# Altium schematic sheet ADAPT.SchDoc
size 999 x 999 mm
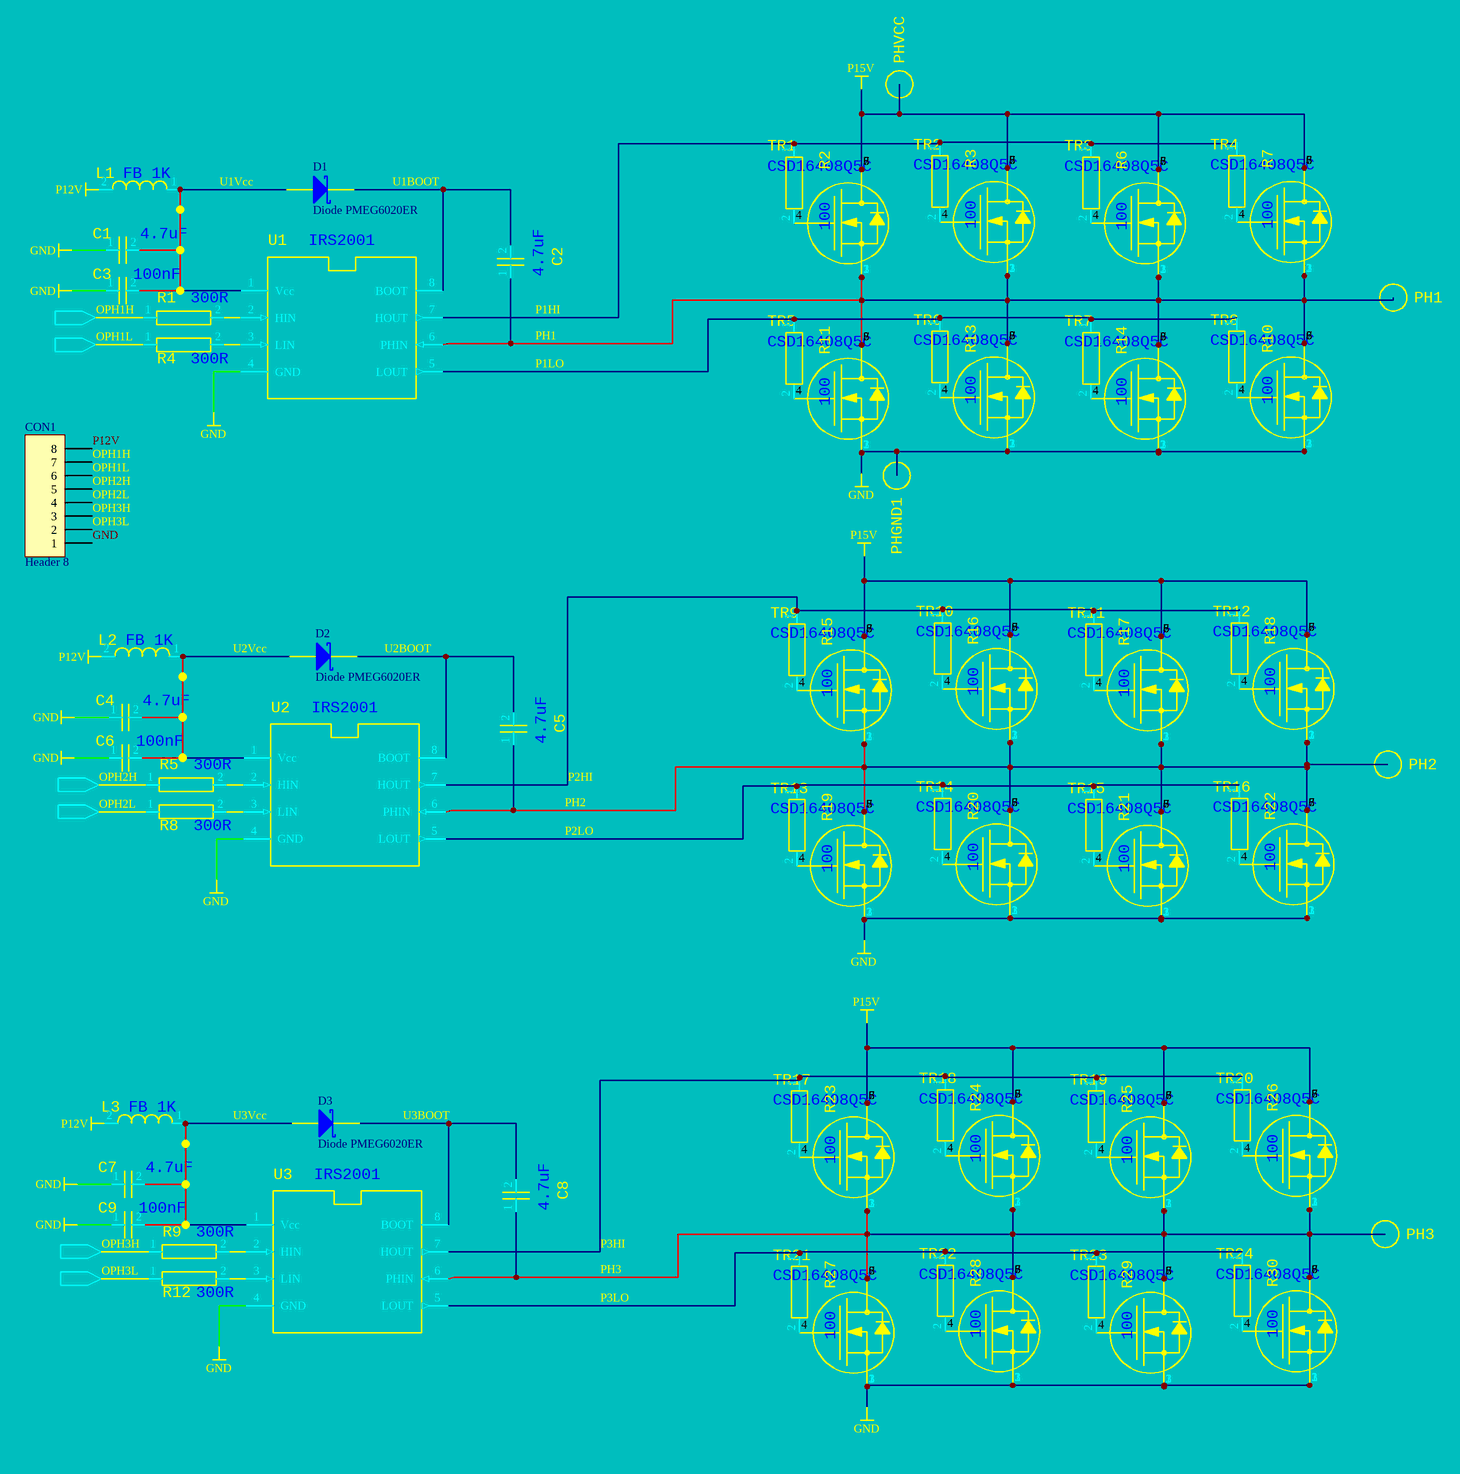
[diagram p0: ADAPT.SchDoc]

## Parts
(Parts that share a designator on the sheet are numbered #1, #2 ... from top to bottom, then left to right.)
?#1  (no value)  (graphical)
?#2  (no value)  (graphical)
?#3  (no value)  (graphical)
?#4  (no value)  (graphical)
?#5  (no value)  (graphical)
?#6  (no value)  (graphical)
C1  4.7uF  [0805_N]
C2  4.7uF  [C1206]
C3  100nF  [1608[0603]]
C4  4.7uF  [0805_N]
C5  4.7uF  [C1206]
C6  100nF  [1608[0603]]
C7  4.7uF  [0805_N]
C8  4.7uF  [C1206]
C9  100nF  [1608[0603]]
CON1  Header 8  [HDR1X8]
D1  Diode PMEG6020ER
D2  Diode PMEG6020ER
D3  Diode PMEG6020ER
L1  FB 1K  [0805_N]
L2  FB 1K  [0805_N]
L3  FB 1K  [0805_N]
PH1  PPAD  [mec-hole3.2mm /5.0 MM]  (value not drawn)
PH2  PPAD  [mec-hole3.2mm /5.0 MM]  (value not drawn)
PH3  PPAD  [mec-hole3.2mm /5.0 MM]  (value not drawn)
PHGND1  PPAD  [mec-hole3.2mm /5.0 MM]  (value not drawn)
PHVCC  PPAD  [mec-hole3.2mm /5.0 MM]  (value not drawn)
R1  300R  [1608[0603]]
R2  100  [1608[0603]]
R3  100  [1608[0603]]
R4  300R  [1608[0603]]
R5  300R  [1608[0603]]
R6  100  [1608[0603]]
R7  100  [1608[0603]]
R8  300R  [1608[0603]]
R9  300R  [1608[0603]]
R10  100  [1608[0603]]
R11  100  [1608[0603]]
R12  300R  [1608[0603]]
R13  100  [1608[0603]]
R14  100  [1608[0603]]
R15  100  [1608[0603]]
R16  100  [1608[0603]]
R17  100  [1608[0603]]
R18  100  [1608[0603]]
R19  100  [1608[0603]]
R20  100  [1608[0603]]
R21  100  [1608[0603]]
R22  100  [1608[0603]]
R23  100  [1608[0603]]
R24  100  [1608[0603]]
R25  100  [1608[0603]]
R26  100  [1608[0603]]
R27  100  [1608[0603]]
R28  100  [1608[0603]]
R29  100  [1608[0603]]
R30  100  [1608[0603]]
TR1  CSD16408Q5C  [SON5x6]
TR2  CSD16408Q5C  [SON5x6]
TR3  CSD16408Q5C  [SON5x6]
TR4  CSD16408Q5C  [SON5x6]
TR5  CSD16408Q5C  [SON5x6]
TR6  CSD16408Q5C  [SON5x6]
TR7  CSD16408Q5C  [SON5x6]
TR8  CSD16408Q5C  [SON5x6]
TR9  CSD16408Q5C  [SON5x6]
TR10  CSD16408Q5C  [SON5x6]
TR11  CSD16408Q5C  [SON5x6]
TR12  CSD16408Q5C  [SON5x6]
TR13  CSD16408Q5C  [SON5x6]
TR14  CSD16408Q5C  [SON5x6]
TR15  CSD16408Q5C  [SON5x6]
TR16  CSD16408Q5C  [SON5x6]
TR17  CSD16408Q5C  [SON5x6]
TR18  CSD16408Q5C  [SON5x6]
TR19  CSD16408Q5C  [SON5x6]
TR20  CSD16408Q5C  [SON5x6]
TR21  CSD16408Q5C  [SON5x6]
TR22  CSD16408Q5C  [SON5x6]
TR23  CSD16408Q5C  [SON5x6]
TR24  CSD16408Q5C  [SON5x6]
U1  IRS2001  [SO8 (reflow)]
U2  IRS2001  [SO8 (reflow)]
U3  IRS2001  [SO8 (reflow)]

## Nets
GND: C1.1 C3.1 C4.1 C6.1 C7.1 C9.1 CON1.1 PHGND1.1 TR5.1 TR5.2 TR5.3 TR6.1 TR6.2 TR6.3 TR7.1 TR7.2 TR7.3 TR8.1 TR8.2 TR8.3 TR13.1 TR13.2 TR13.3 TR14.1 TR14.2 TR14.3 TR15.1 TR15.2 TR15.3 TR16.1 TR16.2 TR16.3 TR21.1 TR21.2 TR21.3 TR22.1 TR22.2 TR22.3 TR23.1 TR23.2 TR23.3 TR24.1 TR24.2 TR24.3 U1.4(GND) U2.4(GND) U3.4(GND)
P12V: CON1.8 L1.2 L2.2 L3.2
P15V: PHVCC.1 TR1.5 TR1.6 TR1.7 TR1.8 TR2.5 TR2.6 TR2.7 TR2.8 TR3.5 TR3.6 TR3.7 TR3.8 TR4.5 TR4.6 TR4.7 TR4.8 TR9.5 TR9.6 TR9.7 TR9.8 TR10.5 TR10.6 TR10.7 TR10.8 TR11.5 TR11.6 TR11.7 TR11.8 TR12.5 TR12.6 TR12.7 TR12.8 TR17.5 TR17.6 TR17.7 TR17.8 TR18.5 TR18.6 TR18.7 TR18.8 TR19.5 TR19.6 TR19.7 TR19.8 TR20.5 TR20.6 TR20.7 TR20.8
OPH1H: ?#1.1 CON1.7 R1.1
OPH1L: ?#2.1 CON1.6 R4.1
OPH2H: ?#3.1 CON1.5 R5.1
OPH2L: ?#4.1 CON1.4 R8.1
OPH3H: ?#5.1 CON1.3 R9.1
OPH3L: ?#6.1 CON1.2 R12.1
P1HI: R2.1 R3.1 R6.1 R7.1 U1.7(HOUT)
P1LO: R10.1 R11.1 R13.1 R14.1 U1.5(LOUT)
P2HI: R15.1 R16.1 R17.1 R18.1 U2.7(HOUT)
P2LO: R19.1 R20.1 R21.1 R22.1 U2.5(LOUT)
P3HI: R23.1 R24.1 R25.1 R26.1 U3.7(HOUT)
P3LO: R27.1 R28.1 R29.1 R30.1 U3.5(LOUT)
PH1: C2.1 PH1.1 TR1.1 TR1.2 TR1.3 TR2.1 TR2.2 TR2.3 TR3.1 TR3.2 TR3.3 TR4.1 TR4.2 TR4.3 TR5.5 TR5.6 TR5.7 TR5.8 TR6.5 TR6.6 TR6.7 TR6.8 TR7.5 TR7.6 TR7.7 TR7.8 TR8.5 TR8.6 TR8.7 TR8.8 U1.6(PHIN)
PH2: C5.1 PH2.1 TR9.1 TR9.2 TR9.3 TR10.1 TR10.2 TR10.3 TR11.1 TR11.2 TR11.3 TR12.1 TR12.2 TR12.3 TR13.5 TR13.6 TR13.7 TR13.8 TR14.5 TR14.6 TR14.7 TR14.8 TR15.5 TR15.6 TR15.7 TR15.8 TR16.5 TR16.6 TR16.7 TR16.8 U2.6(PHIN)
PH3: C8.1 PH3.1 TR17.1 TR17.2 TR17.3 TR18.1 TR18.2 TR18.3 TR19.1 TR19.2 TR19.3 TR20.1 TR20.2 TR20.3 TR21.5 TR21.6 TR21.7 TR21.8 TR22.5 TR22.6 TR22.7 TR22.8 TR23.5 TR23.6 TR23.7 TR23.8 TR24.5 TR24.6 TR24.7 TR24.8 U3.6(PHIN)
U1BOOT: C2.2 D1.1(K) U1.8(BOOT)
U1Vcc: C1.2 C3.2 D1.2(A) L1.1 U1.1(Vcc)
U2BOOT: C5.2 D2.1(K) U2.8(BOOT)
U2Vcc: C4.2 C6.2 D2.2(A) L2.1 U2.1(Vcc)
U3BOOT: C8.2 D3.1(K) U3.8(BOOT)
U3Vcc: C7.2 C9.2 D3.2(A) L3.1 U3.1(Vcc)
NetR1_2: R1.2 U1.2(HIN)
NetR2_2: R2.2 TR1.4
NetR3_2: R3.2 TR2.4
NetR4_2: R4.2 U1.3(LIN)
NetR5_2: R5.2 U2.2(HIN)
NetR6_2: R6.2 TR3.4
NetR7_2: R7.2 TR4.4
NetR8_2: R8.2 U2.3(LIN)
NetR9_2: R9.2 U3.2(HIN)
NetR10_2: R10.2 TR8.4
NetR11_2: R11.2 TR5.4
NetR12_2: R12.2 U3.3(LIN)
NetR13_2: R13.2 TR6.4
NetR14_2: R14.2 TR7.4
NetR15_2: R15.2 TR9.4
NetR16_2: R16.2 TR10.4
NetR17_2: R17.2 TR11.4
NetR18_2: R18.2 TR12.4
NetR19_2: R19.2 TR13.4
NetR20_2: R20.2 TR14.4
NetR21_2: R21.2 TR15.4
NetR22_2: R22.2 TR16.4
NetR23_2: R23.2 TR17.4
NetR24_2: R24.2 TR18.4
NetR25_2: R25.2 TR19.4
NetR26_2: R26.2 TR20.4
NetR27_2: R27.2 TR21.4
NetR28_2: R28.2 TR22.4
NetR29_2: R29.2 TR23.4
NetR30_2: R30.2 TR24.4

## Library data of the parts
?#1-?#6 = SIGNALREF (externalin)
C1 C4 C7 = C10u-10%-0805: 4.7uF Surface mount CAP 0805 10% 50V; (OldCtfName): (CTF_OLD_NAME_INVALID); Value: 4.7uF; Tolerance: 10%; Voltage: 50V
C2 C5 C8 = C10uF/63V-1210: 4.7uF Surface mount CAP 0805 10% 50V; Tolerance: 20%; (OldCtfName): (CTF_OLD_NAME_INVALID); Voltage: 50V; Value: 4.7uF
C3 C6 C9 = C100n-10%-0603: 100nF Surface mount CAP 0603 10% 50V; (OldCtfName): (CTF_OLD_NAME_INVALID); Value: 100nF; Tolerance: 10%; Voltage: 50V
CON1 = Header 8: Header, 8-Pin; LatestRevisionDate: 17-Jul-2002; LatestRevisionNote: Re-released for DXP Platform.; Publisher: Altium Limited
D1-D3 = Diode BPMEG6020ER: Silicon RF Schottky Diode for Mixer Applications in the VHF/UHF Range; Note: Pin 2 is not connected and not drawn.; Published: 21-Mar-2003; LatestRevisionDate: 29-May-2009; LatestRevisionNote: IPC-7351 Footprint Added.; DatasheetVersion: Oct-1999; PackageVersion: Sep-2001; PackageReference: SOT-23; Publisher: Altium Limited; PackageDescription: 3-Pin SOT-23 Package 0.95 mm Pitch, 2.5 mm Lead Span; ComponentLink1Description: Manufacturer Link; ComponentLink1URL: http://www.infineon.com/; ComponentLink2Description: Datasheet; ComponentLink2URL: http://www.infineon.com/upload/Document/cmc_upload/documents/009/363/bat17series.pdf
L1-L3 = XAL4030-332-MEB: Ferrite Bead 1K 0805; Tolerance: 20%; (OldCtfName): (CTF_OLD_NAME_INVALID); Value: FB 1K; Elec_type: ferrite bead
PH1-PH3 PHGND1 PHVCC = I-GAT 3.2/5 mm: Power Pad; (OldCtfName): (CTF_OLD_NAME_INVALID)
R1 R4 R5 R8 R9 R12 = R300-1%-0603: 300R SMD 0603 1%; Wattage: 0.065W; (OldCtfName): (CTF_OLD_NAME_INVALID); Value: 300R; Tolerance: 1%
R2 R3 R6 R7 R10 R11 R13-R30 = RS: 100R SMD 0603 1%; Wattage: 0.065W; (OldCtfName): (CTF_OLD_NAME_INVALID); Tolerance: 1%; Value: 100
TR1-TR24 = CSD16408Q5C: N-CHANNEL MOSFET DirectFet; Manufacturer: TI; (OldCtfName): (CTF_OLD_NAME_INVALID); Value: CSD16408Q5C
U1-U3 = IRS2001: DOUBLE MOSFET DRIVED; Manufacturer: TI; (OldCtfName): (CTF_OLD_NAME_INVALID); Value: IRS2001